# EAGLE design clock (EAGLE 9.5.2)

## Sheet 1 of 4
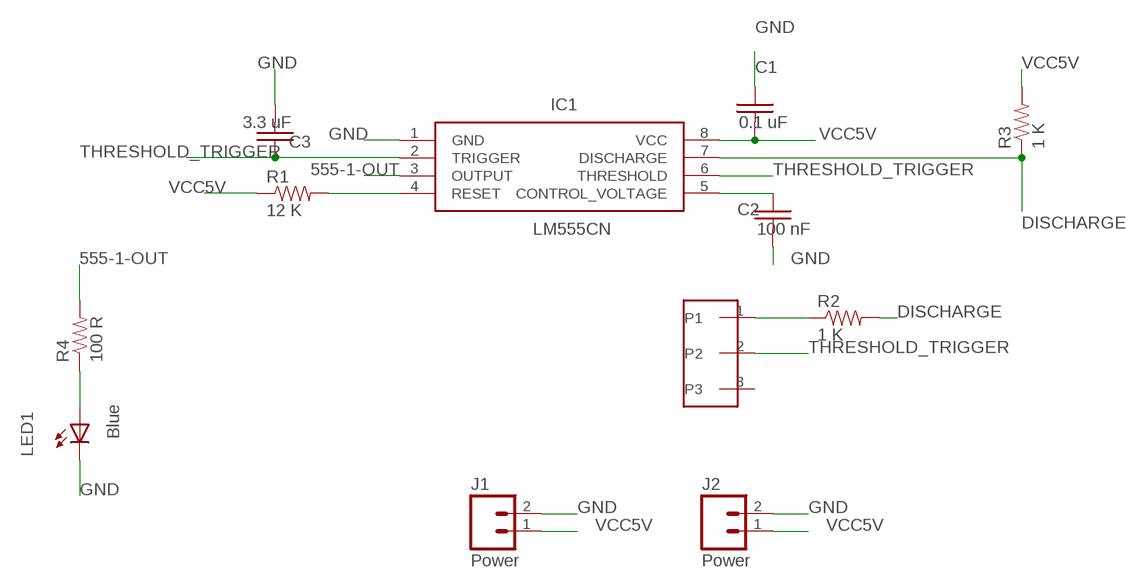
[diagram p0: schematic, sheet 1]

### Parts
C1  0.1 uF  C-USC0805  [C0805]
C2  100 nF  C-USC0805K  [C0805K]
C3  3.3 uF  C-USC0805  [C0805]
IC1  LM555CN  [DIP762W53P254L980H533Q8N]
J1  Power  M02PTH  [1X02]
J2  Power  M02PTH  [1X02]
LED1  Blue  LED-3MM-NO_SILK  [LED3MM-NS]
R1  12 K  RESISTOR0805-RES  [0805]
R2  1 K  RESISTOR0805-RES  [0805]
R3  1 K  RESISTOR0805-RES  [0805]
R4  100 R  RESISTOR0805-RES  [0805]
U$1  SQUARE-TRIMPOT-POTENTIOMETER  [3/8-SQUARE-TRIMPOT]

### Nets
555-1-OUT: IC1.3(OUTPUT) R4.2 ; also sheet 3
DISCHARGE: IC1.7(DISCHARGE) R2.2 R3.1
GND: C1.1 C2.2 C3.2 IC1.1(GND) J1.2 J2.2 LED1.K(C) ; also sheet 2,3
N$1: IC1.4(RESET) R1.2
N$2: C2.1 IC1.5(CONTROL_VOLTAGE)
N$3: R2.1 U$1.1
N$4: LED1.A R4.1
THRESHOLD_TRIGGER: C3.1 IC1.2(TRIGGER) IC1.6(THRESHOLD) U$1.2
VCC5V: C1.2 IC1.8(VCC) J1.1 J2.1 R1.1 R3.2 ; also sheet 2,3
Unconnected: U$1.3

## Sheet 2 of 4
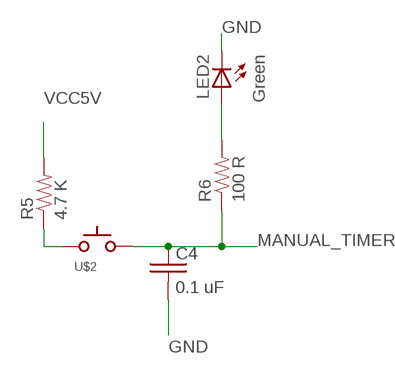
[diagram p1: schematic, sheet 2]

### Parts
C4  0.1 uF  C-USC0805  [C0805]
LED2  Green  LED-3MM-NO_SILK  [LED3MM-NS]
R5  4.7 K  RESISTOR0805-RES  [0805]
R6  100 R  RESISTOR0805-RES  [0805]
U$2  SWITCH_TACTILETACTILE_PIN  [TACTILE-PTH]

### Nets
GND: C4.2 LED2.K(C) ; also sheet 1,3
MANUAL_TIMER: C4.1 R6.1 U$2.1(A) U$2.2(A) ; also sheet 3
N$5: LED2.A R6.2
N$6: R5.1 U$2.3(C) U$2.4(C)
VCC5V: R5.2 ; also sheet 1,3

## Sheet 3 of 4
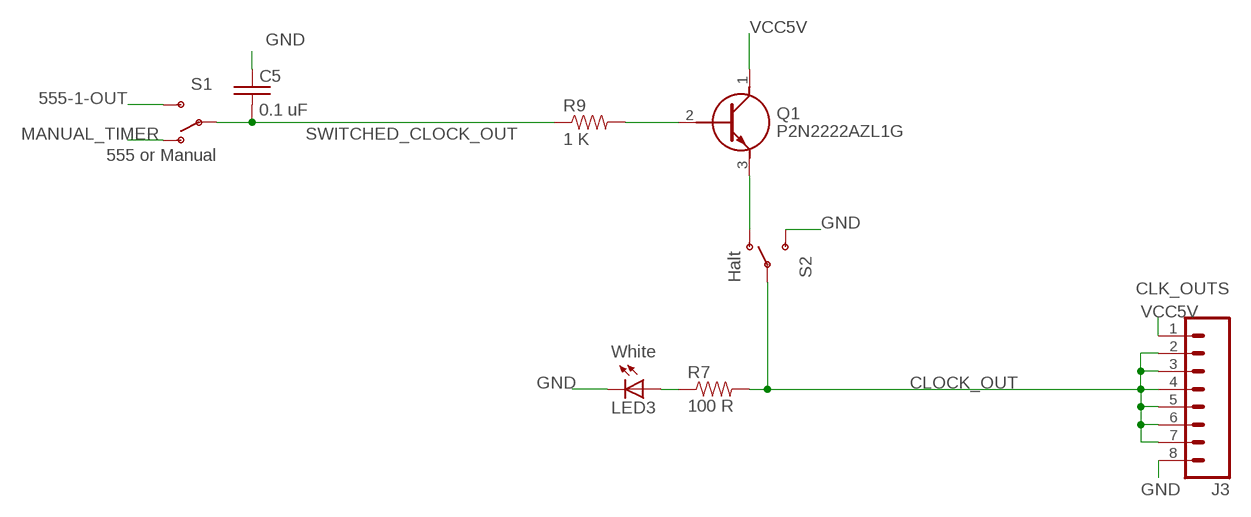
[diagram p2: schematic, sheet 3]

### Parts
C5  0.1 uF  C-USC0805  [C0805]
J3  CLK_OUTS  M08SILK_FEMALE_PTH  [1X08]
LED3  White  LED-3MM-NO_SILK  [LED3MM-NS]
Q1  P2N2222AZL1G  [2N6027]
R7  100 R  RESISTOR0805-RES  [0805]
R9  1 K  RESISTOR0805-RES  [0805]
S1  555 or Manual  SWITCH-SPSTKIT  [SWITCH-SPDT_KIT]
S2  Halt  SWITCH-SPSTKIT  [SWITCH-SPDT_KIT]

### Nets
555-1-OUT: S1.3(S) ; also sheet 1
CLOCK_OUT: J3.2 J3.3 J3.4 J3.5 J3.6 J3.7 R7.2 S2.2(P)
GND: C5.1 J3.8 LED3.K(C) S2.3(S) ; also sheet 1,2
MANUAL_TIMER: S1.1(O) ; also sheet 2
N$7: LED3.A R7.1
N$10: Q1.3(E) S2.1(O)
N$12: Q1.2(B) R9.2
SWITCHED_CLOCK_OUT: C5.2 R9.1 S1.2(P)
VCC5V: J3.1 Q1.1(C) ; also sheet 1,2

## Sheet 4 of 4
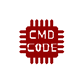
[diagram p3: schematic, sheet 4]

### Parts
U$3  CMD_C0DE_LOGOCMD_CODE_LOGO_TOP_COPPER  [CMD_C0DE_LOGO_TOP_COPPER]

## Library data of the parts
C1-C5 = passives:C-US: CAPACITOR, American symbol
IC1 = ICs:LM555CN: ON Semiconductor LM555CN, Timer, 4.5 16 V, 8-Pin PDIP Source: Datasheet <http://www.onsemi.com/pub/Collateral/LM555-D.pdf>; ALLIED_NUMBER: 71229669; ALLIED_PRICE-STOCK: https://www.alliedelec.com/on-semiconductor-lm555cn/71229669/; DESCRIPTION: ON Semiconductor LM555CN, Timer, 4.5 16 V, 8-Pin PDIP; HEIGHT: 5.33mm; MANUFACTURER_NAME: ON Semiconductor; MANUFACTURER_PART_NUMBER: LM555CN; MOUSER_PART_NUMBER: 512-LM555CN; RS_PART_NUMBER: 1698718; RS_PRICE-STOCK: http://uk.rs-online.com/web/p/products/1698718
J1 J2 = connector:M02: Standard 2-pin 0.1" header. Use with - straight break away headers ( PRT-00116) - right angle break away headers (PRT-00553) - swiss pins (PRT-00743) - machine pins (PRT-00117) - female headers (PRT-00115) Molex polarized connector foot print use with: PRT-08233 with associated crimp pins and housings. 2.54_SCREWTERM for use with PRT-10571. 3.5mm Screw Terminal footprints for PRT-08084 5mm Screw Terminal footprints for use with PRT-08432
J3 = connector:M08: Header 8 Standard 8-pin 0.1" header. Use with straight break away headers (SKU : PRT-00116), right angle break away headers (PRT-00553), swiss pins (PRT-00743), machine pins (PRT-00117), and female headers (PRT-00115).; PROD_ID: CONN-08438
LED1-LED3 = leds:LED: LEDs Standard schematic elements and footprints for 5mm, 3mm, 1206, and 0603 sized LEDs. 5mm - Spark Fun Electronics SKU : COM-00529 (and others)
Q1 = transitors:P2N2222AZL1G: Bipolar Transistors - BJT 600mA 75V NPN Source: Datasheet <https://media.digikey.com/pdf/Data Sheets/ON Semiconductor PDFs/P2N2222A Rev3.pdf>; DESCRIPTION: Bipolar Transistors - BJT 600mA 75V NPN; HEIGHT: mm; MANUFACTURER_NAME: ON Semiconductor; MANUFACTURER_PART_NUMBER: P2N2222AZL1G; MOUSER_PART_NUMBER: 863-P2N2222AZL1G; MOUSER_PRICE-STOCK: https://www.mouser.com/Search/Refine.aspx?Keyword=863-P2N2222AZL1G
R1-R7 R9 = passives:RESISTOR: Resistor Basic schematic elements and footprints for 0603, 1206, and PTH resistors.
S1 S2 = switches:SWITCH-SPST: SPST Switch Simple slide switch.
U$1 = passives:SQUARE-TRIMPOT-POTENTIOMETER
U$2 = switches:SWITCH_TACTILE
U$3 = logos:CMD_C0DE_LOGO

## Board
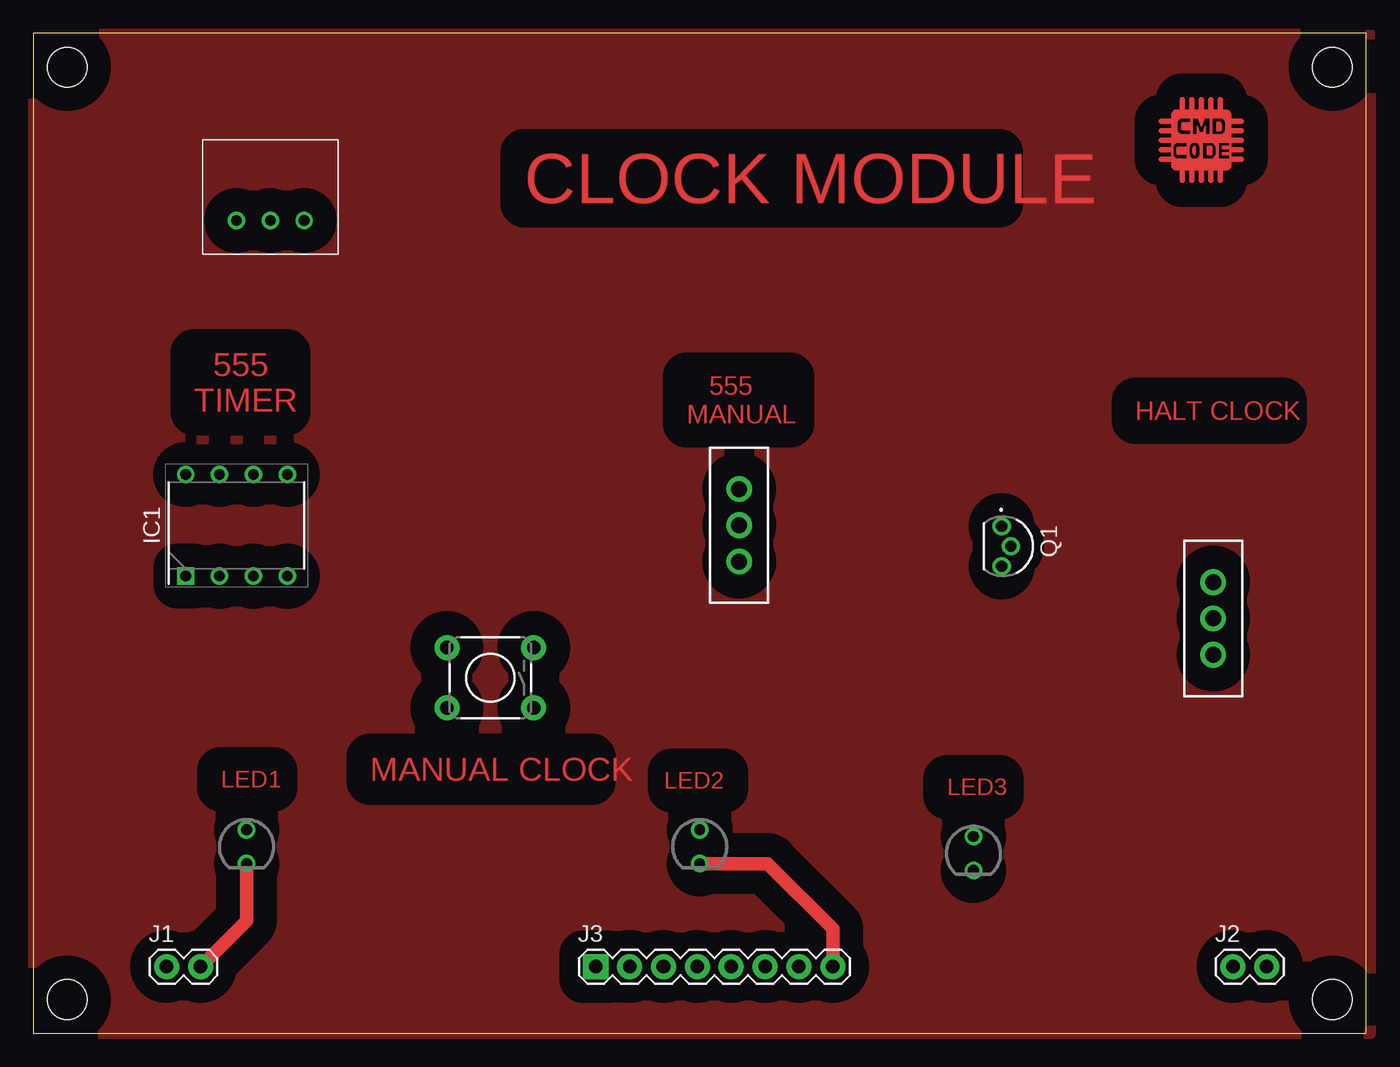
[diagram p4: board, top side]
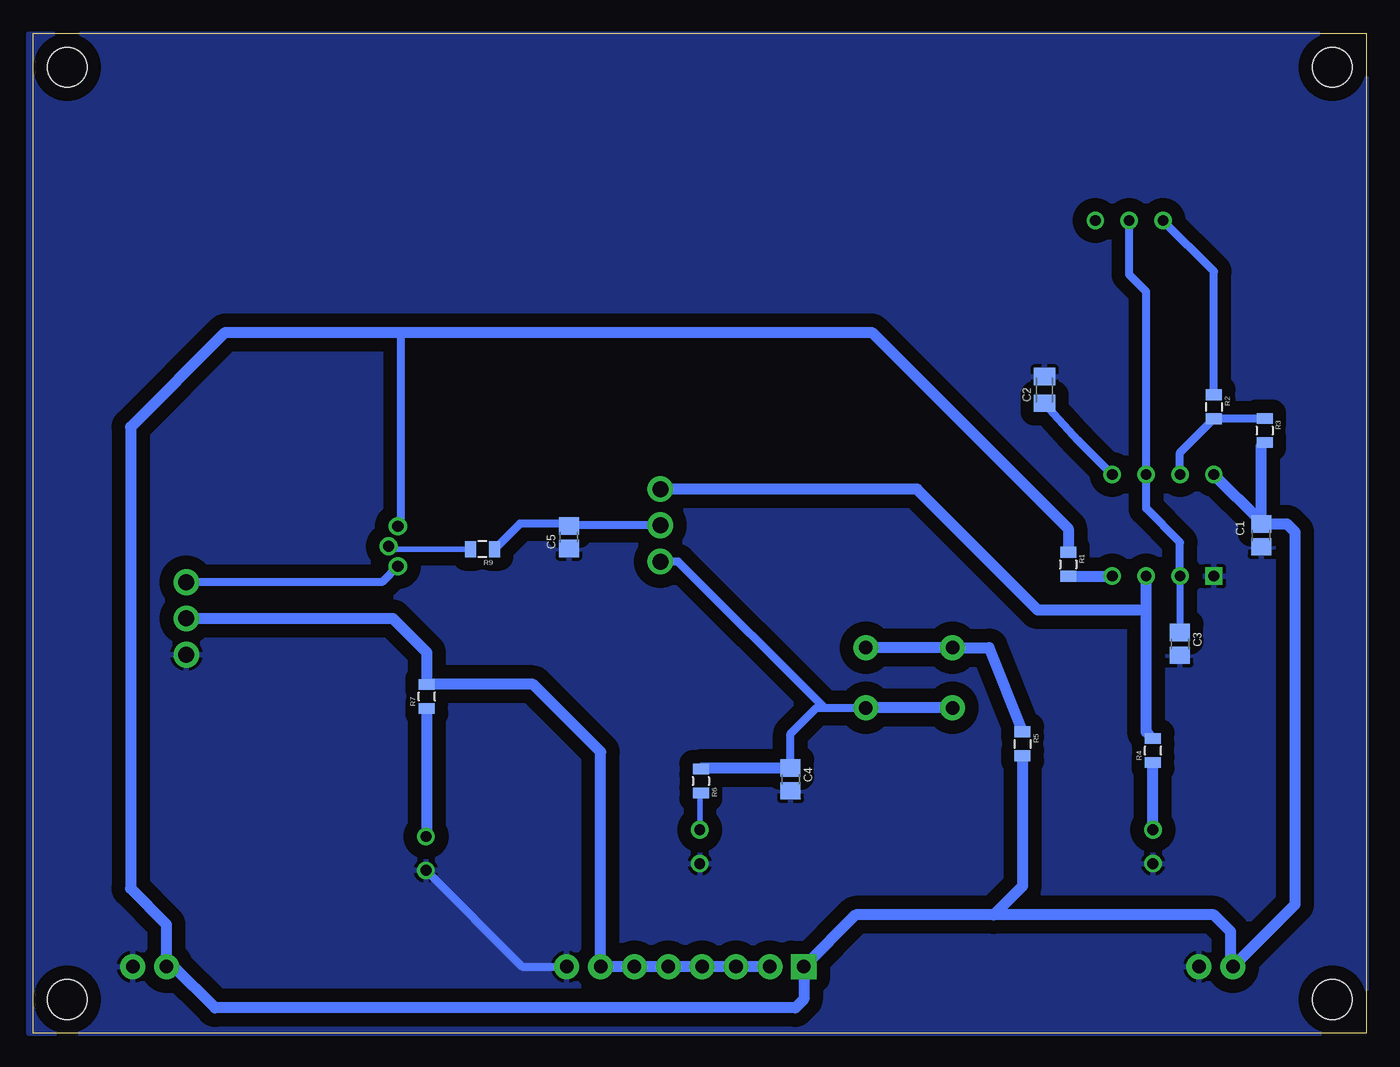
[diagram p5: board, bottom side, seen from below]

Size 100 x 75 mm. Coordinates in mm from the lower left corner, seen from the top.
Outline: 0,0 100,0 100,75 0,75 0,0
Copper layers (1*16): Top 0.035mm / dielectric 1.5mm / Bottom 0.035mm
Design rules "OthermillDRC_1_100_v2": minimum track width 8mil, minimum drill 0.8mm, track to track 0.256540625mm, track to pad 0.256540625mm, pad to pad 0.256540625mm, via to via 0.256540625mm, smd to smd 0mil, copper to edge 0mil, drill to drill 1mil, minimum pad ring 10mil, minimum via ring 10mil, stop-mask expansion 1mil, vias tented up to drill 30mil, thermal gap 10mil
Holes 3 mm at 2.54,2.54 97.46,2.54 97.46,72.46 2.54,72.46

### Footprints (pad centres in the part's own frame; a part is rotated, then mirrored left to right if it is on the bottom)
C0805 = smd 1.3 x 1.5: 1 -0.85,0; 2 0.85,0
C0805K = smd 1.3 x 1.6: 1 -1,0; 2 1,0
DIP762W53P254L980H533Q8N = drill 0.8 pad 1.13 square: 1 -3.81,3.81 | drill 0.8 pad 1.13: 2 -3.81,1.27; 3 -3.81,-1.27; 4 -3.81,-3.81; 5 3.81,-3.81; 6 3.81,-1.27; 7 3.81,1.27; 8 3.81,3.81
1X02 = drill 1.016 pad 1.88: 1 0,0; 2 2.54,0
1X08 = drill 1.016 pad 1.88 square: 1 0,0 | drill 1.016 pad 1.88: 2 2.54,0; 3 5.08,0; 4 7.62,0; 5 10.16,0; 6 12.7,0; 7 15.24,0; 8 17.78,0
LED3MM-NS = drill 0.813: A -1.27,0; K 1.27,0
2N6027 = drill 0.85 pad 1.35: 1 -1.5,-2.35; 2 0,-1.65; 3 1.5,-2.35
0805 = smd 0.8 x 1.2: 1 -0.9,0; 2 0.9,0
SWITCH-SPDT_KIT = drill 1.2 pad 1.93: 1 0,2.718; 2 0,0; 3 0,-2.718
3/8-SQUARE-TRIMPOT = drill 0.8: 1 -2.54,0; 2 0,0; 3 2.54,0
TACTILE-PTH = drill 1.016 pad 1.88: 1 -3.251,2.261; 2 3.251,2.261; 3 -3.251,-2.261; 4 3.251,-2.261

### Placement (x,y rotation side)
C1  7.87,37.34 90 bottom
C2  24.13,48.26 90 bottom
C3  13.97,29.21 270 bottom
C4  43.18,19.05 270 bottom
C5  59.82,37.21 90 bottom
IC1  15.24,38.1 90 top
J1  10,5 0 top
J2  90,5 0 top
J3  42.2,5 0 top
LED1  16,14 270 top
LED2  50,14 270 top
LED3  70.54,13.49 270 top
Q1  75,36.53 270 top
R1  22.35,35.18 270 bottom
R2  11.43,46.99 270 bottom
R3  7.62,45.21 270 bottom
R4  16,21.21 90 bottom
R5  25.78,21.72 270 bottom
R6  49.91,18.92 270 bottom
R7  70.48,25.27 90 bottom
R9  66.29,36.32 180 bottom
S1  52.96,38.1 180 top
S2  88.52,31.11 0 top
U$1  17.78,60.96 0 top
U$2  34.29,26.67 180 top
U$3  87.63,67.31 0 top

### Tracks (layer width: path | path; a pad name or v marks a point on that pad's centre or on a via)
555-1-OUT
  Bottom 0.813: R4.2 16.51,22.62 16.51,31.75 | 16.51,31.75 IC1.3 | 16.51,31.75 24.64,31.75 33.71,40.82 S1.3
CLOCK_OUT
  Bottom 0.813: J3.2 J3.3 J3.4 J3.5 J3.6 J3.7 57.44,21.12 62.49,26.17 R7.2 70.48,28.57 73.03,31.11 S2.2
DISCHARGE
  Bottom 0.61: IC1.7 13.97,43.55 R2.2 11.41,46.11 R3.1
GND
  Top 1.016: J1.2 16,8.46 LED1.K | J3.8 59.98,7.84 55.09,12.73 LED2.K
  Bottom 0.61: LED3.K 63.32,5 J3.8
  pour Bottom (isolate 1.016): 0,74.93 0,0 100.33,0 100.33,74.93
MANUAL_TIMER
  Bottom 0.61: C4.1 43.18,22.48 41.25,24.41 40.64,24.41 | 40.64,24.41 U$2.1 | 40.64,24.41 51.61,35.38 S1.1
  Bottom 0.813: U$2.2 U$2.1 | C4.1 49.83,19.9 R6.1
N$1
  Bottom 0.813: R1.2 IC1.4
N$2
  Bottom 0.61: IC1.5 21.59,44.45 C2.1
N$3
  Bottom 0.61: R2.1 11.43,57.15 U$1.1
N$4
  Bottom 0.508: R4.1
  Bottom 0.813: LED1.A R4.1
N$5
  Bottom 0.406: LED2.A 50,17.93
  Bottom 0.61: 50,17.93 R6.2
N$6
  Bottom 0.813: R5.1 28.29,28.93 U$2.4 U$2.3
N$7
  Bottom 0.61: 70.48,14.81 LED3.A
  Bottom 0.813: R7.1 70.48,14.81
N$10
  Bottom 0.61: Q1.3 73.85,33.83 S2.1
N$12
  Bottom 0.406: R9.2 73.14,36.32 Q1.2
NOTHING
  pour Top (isolate 1.778): 0,74.93 0,0 100.33,0 100.33,74.93
SWITCHED_CLOCK_OUT
  Bottom 0.61: S1.2 59.78,38.1 C5.2 59.98,38.23 63.49,38.23 R9.1
THRESHOLD_TRIGGER
  Bottom 0.508: IC1.2 C3.1
  Bottom 0.61: U$1.2 17.78,56.9 16.51,55.63 IC1.6 16.51,39.37 13.97,36.83 IC1.2
VCC5V
  Bottom 0.61: Q1.1 72.39,38.29 72.39,52.58
  Bottom 0.813: 27.94,8.89 11.43,8.89 10.16,7.62 10.16,5.16 J1.1 5.33,9.67 5.33,37.59 5.93,38.19 C1.2 | 27.94,8.89 38.31,8.89 J3.1 42.2,2.54 42.84,1.91 86.36,1.91 89.45,5 J2.1 90,8.15 92.71,10.86 92.71,45.47 85.6,52.58 72.39,52.58 37.08,52.58 22.35,37.85 R1.1 | R5.2 25.78,11.05 27.94,8.89 | C1.2 7.87,38.35 IC1.8 | C1.2 7.87,44.06 R3.2

### Text on the board
Top: CLOCK MODULE | 555 / TIMER | 555 / MANUAL | HALT CLOCK | MANUAL CLOCK